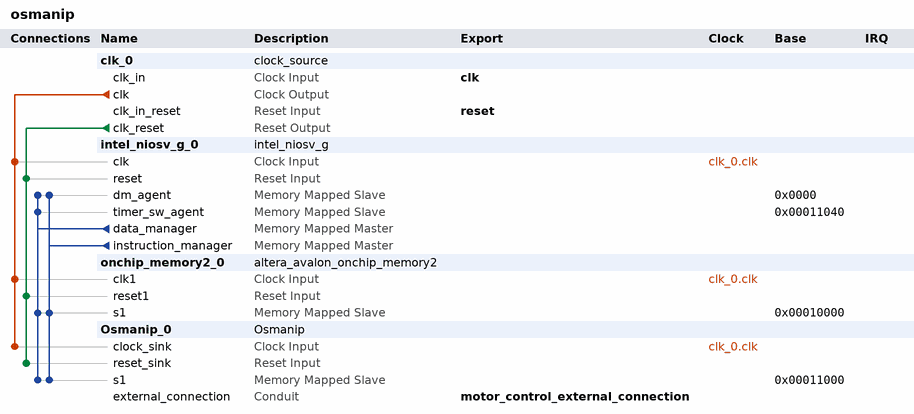
[diagram p0: system contents]
# Platform Designer (Qsys) system osmanip, Cyclone V 5CSEMA4U23C6
# Parameters at their usual value, and those the tool derives, are not listed.
package require -exact qsys 24.1
create_system osmanip
set_project_property DEVICE_FAMILY {Cyclone V}
set_project_property DEVICE 5CSEMA4U23C6

add_instance clk_0 clock_source 24.1
set_instance_parameter_value clk_0 clockFrequency 50000000

add_instance intel_niosv_g_0 intel_niosv_g 4.0.0
set_instance_parameter_value intel_niosv_g_0 Blind_Window_Period 1000
set_instance_parameter_value intel_niosv_g_0 CLICenabledInterruptMode 0
set_instance_parameter_value intel_niosv_g_0 CLICenabledShadowRegisterFiles 1
set_instance_parameter_value intel_niosv_g_0 Default_Timeout_Period 255
set_instance_parameter_value intel_niosv_g_0 alignCLICVectorTable 8
set_instance_parameter_value intel_niosv_g_0 basicInterruptMode 0
set_instance_parameter_value intel_niosv_g_0 basicShadowRegisterFiles 0
set_instance_parameter_value intel_niosv_g_0 clockFrequency 50000000
set_instance_parameter_value intel_niosv_g_0 dataCacheSize 4096
set_instance_parameter_value intel_niosv_g_0 disableFsqrtFdiv false
set_instance_parameter_value intel_niosv_g_0 dtcm1Base 0
set_instance_parameter_value intel_niosv_g_0 dtcm1Size 0
set_instance_parameter_value intel_niosv_g_0 dtcm2Base 0
set_instance_parameter_value intel_niosv_g_0 dtcm2Size 0
set_instance_parameter_value intel_niosv_g_0 enableBranchPrediction true
set_instance_parameter_value intel_niosv_g_0 enableCLICInterruptEdgeTriggerConfig false
set_instance_parameter_value intel_niosv_g_0 enableCLICInterruptPolarityConfig false
set_instance_parameter_value intel_niosv_g_0 enableCLICSelectiveHardwareVectoring false
set_instance_parameter_value intel_niosv_g_0 enableCoreLevelInterruptController false
set_instance_parameter_value intel_niosv_g_0 enableDebug true
set_instance_parameter_value intel_niosv_g_0 enableDebugReset false
set_instance_parameter_value intel_niosv_g_0 enableECCFull false
set_instance_parameter_value intel_niosv_g_0 enableECCLite false
set_instance_parameter_value intel_niosv_g_0 enableFPU false
set_instance_parameter_value intel_niosv_g_0 enableLockstep false
set_instance_parameter_value intel_niosv_g_0 enableLockstepExtRst false
set_instance_parameter_value intel_niosv_g_0 enableMulDiv true
set_instance_parameter_value intel_niosv_g_0 hartId 0
set_instance_parameter_value intel_niosv_g_0 instCacheSize 4096
set_instance_parameter_value intel_niosv_g_0 itcm1Base 0
set_instance_parameter_value intel_niosv_g_0 itcm1Size 0
set_instance_parameter_value intel_niosv_g_0 itcm2Base 0
set_instance_parameter_value intel_niosv_g_0 itcm2Size 0
set_instance_parameter_value intel_niosv_g_0 numCLICDebugTriggers 0
set_instance_parameter_value intel_niosv_g_0 numCLICLevels 2
set_instance_parameter_value intel_niosv_g_0 numCLICPlatformInterrupts 16
set_instance_parameter_value intel_niosv_g_0 numCLICPriorities 8
set_instance_parameter_value intel_niosv_g_0 peripheralRegionABase 0
set_instance_parameter_value intel_niosv_g_0 peripheralRegionASize 65536
set_instance_parameter_value intel_niosv_g_0 peripheralRegionBBase 0
set_instance_parameter_value intel_niosv_g_0 peripheralRegionBSize 0
set_instance_parameter_value intel_niosv_g_0 resetOffset 0
set_instance_parameter_value intel_niosv_g_0 resetSlave Absolute
set_instance_parameter_value intel_niosv_g_0 useResetReq false

add_instance onchip_memory2_0 altera_avalon_onchip_memory2 24.1
set_instance_parameter_value onchip_memory2_0 dataWidth 32
set_instance_parameter_value onchip_memory2_0 dualPort false
set_instance_parameter_value onchip_memory2_0 initMemContent true
set_instance_parameter_value onchip_memory2_0 initializationFileName onchip_mem.hex
set_instance_parameter_value onchip_memory2_0 memorySize 4096

add_instance Osmanip_0 Osmanip 2.0
set_instance_parameter_value Osmanip_0 ADDR_WIDTH 5
set_instance_parameter_value Osmanip_0 ARRAY_SIZE 32
set_instance_parameter_value Osmanip_0 DATA_LENGTH 8
set_instance_parameter_value Osmanip_0 EXERNAL_DATA_LENGTH 8
set_instance_parameter_value Osmanip_0 START_ADDR 31

# connections
add_connection clk_0.clk intel_niosv_g_0.clk clock
add_connection clk_0.clk onchip_memory2_0.clk1 clock
add_connection clk_0.clk Osmanip_0.clock_sink clock
add_connection clk_0.clk_reset intel_niosv_g_0.reset reset
add_connection clk_0.clk_reset onchip_memory2_0.reset1 reset
add_connection clk_0.clk_reset Osmanip_0.reset_sink reset
add_connection intel_niosv_g_0.data_manager intel_niosv_g_0.dm_agent avalon
set_connection_parameter_value intel_niosv_g_0.data_manager/intel_niosv_g_0.dm_agent baseAddress 0x0000
add_connection intel_niosv_g_0.data_manager intel_niosv_g_0.timer_sw_agent avalon
set_connection_parameter_value intel_niosv_g_0.data_manager/intel_niosv_g_0.timer_sw_agent baseAddress 0x00011040
add_connection intel_niosv_g_0.data_manager onchip_memory2_0.s1 avalon
set_connection_parameter_value intel_niosv_g_0.data_manager/onchip_memory2_0.s1 baseAddress 0x00010000
add_connection intel_niosv_g_0.data_manager Osmanip_0.s1 avalon
set_connection_parameter_value intel_niosv_g_0.data_manager/Osmanip_0.s1 baseAddress 0x00011000
add_connection intel_niosv_g_0.instruction_manager intel_niosv_g_0.dm_agent avalon
set_connection_parameter_value intel_niosv_g_0.instruction_manager/intel_niosv_g_0.dm_agent baseAddress 0x0000
add_connection intel_niosv_g_0.instruction_manager onchip_memory2_0.s1 avalon
set_connection_parameter_value intel_niosv_g_0.instruction_manager/onchip_memory2_0.s1 baseAddress 0x00010000
add_connection intel_niosv_g_0.instruction_manager Osmanip_0.s1 avalon
set_connection_parameter_value intel_niosv_g_0.instruction_manager/Osmanip_0.s1 baseAddress 0x00011000

# exported interfaces
add_interface clk clock sink
set_interface_property clk EXPORT_OF clk_0.clk_in
add_interface motor_control_external_connection conduit end
set_interface_property motor_control_external_connection EXPORT_OF Osmanip_0.external_connection
add_interface reset reset sink
set_interface_property reset EXPORT_OF clk_0.clk_in_reset

set_interconnect_requirement {$system} qsys_mm.clockCrossingAdapter HANDSHAKE
set_interconnect_requirement {$system} qsys_mm.enableEccProtection FALSE
set_interconnect_requirement {$system} qsys_mm.insertDefaultSlave FALSE
set_interconnect_requirement {$system} qsys_mm.maxAdditionalLatency 1

save_system osmanip.qsys
